# EAGLE schematic mcu_board (EAGLE 9.6.2)
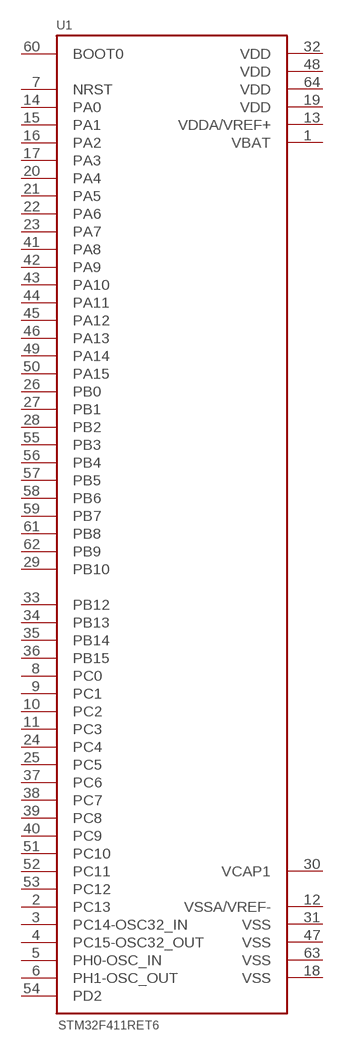
[diagram p0: schematic, sheet 1]

## Parts
U1  STM32F411RET6  [QFP50P1200X1200X160-64N]
Unconnected: U1.2(PC13) U1.3(PC14-OSC32_IN) U1.4(PC15-OSC32_OUT) U1.5(PH0-OSC_IN) U1.6(PH1-OSC_OUT) U1.7(NRST) U1.8(PC0) U1.9(PC1) U1.10(PC2) U1.11(PC3) U1.14(PA0) U1.15(PA1) U1.16(PA2) U1.17(PA3) U1.20(PA4) U1.21(PA5) U1.22(PA6) U1.23(PA7) U1.24(PC4) U1.25(PC5) U1.26(PB0) U1.27(PB1) U1.28(PB2) U1.29(PB10) U1.30(VCAP1) U1.33(PB12) U1.34(PB13) U1.35(PB14) U1.36(PB15) U1.37(PC6) U1.38(PC7) U1.39(PC8) U1.40(PC9) U1.41(PA8) U1.42(PA9) U1.43(PA10) U1.44(PA11) U1.45(PA12) U1.46(PA13) U1.49(PA14) U1.50(PA15) U1.51(PC10) U1.52(PC11) U1.53(PC12) U1.54(PD2) U1.55(PB3) U1.56(PB4) U1.57(PB5) U1.58(PB6) U1.59(PB7) U1.60(BOOT0) U1.61(PB8) U1.62(PB9)

## Power pins joined to a net without a drawn wire
VBAT: U1.1(VBAT)
VDD: U1.19(VDD) U1.32(VDD) U1.48(VDD) U1.64(VDD)
VDDA/VREF+: U1.13(VDDA/VREF+)
VSS: U1.18(VSS) U1.31(VSS) U1.47(VSS) U1.63(VSS)
VSSA/VREF-: U1.12(VSSA/VREF-)

## Library data of the parts
U1 = STM32F411RET6:STM32F411RET6: High-performance access line, ARM Cortex-M4 core with DSP and FPU, 512 Kbytes Flash, 100 MHz CPU, ART Accelerator Check availability <https://pricing.snapeda.com/parts/STM32F411RET6/STMicroelectronics/view-part?ref=eda>; AVAILABILITY: In Stock; DESCRIPTION: ARM® Cortex®-M4 STM32F4 Microcontroller IC 32-Bit Single-Core 100MHz 512KB (512K x 8) FLASH 64-LQFP (10x10); MF: STMicroelectronics; MP: STM32F411RET6; PACKAGE: LQFP-64 STMicroelectronics; PRICE: None; PURCHASE-URL: https://pricing.snapeda.com/search/part/STM32F411RET6/?ref=eda